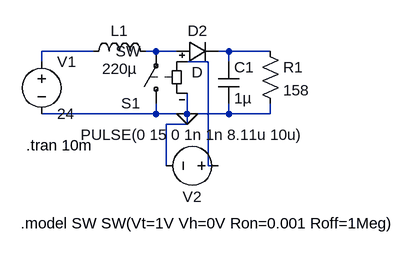
[diagram p0: schematic simulation.asc]
simulation.asc, the LTspice schematic file:
Version 4.1
SHEET 1 2348 680
WIRE 176 96 96 96
WIRE 272 96 256 96
WIRE 304 96 272 96
WIRE 384 96 368 96
WIRE 448 96 384 96
WIRE 96 112 96 96
WIRE 352 112 320 112
WIRE 384 112 384 96
WIRE 272 192 272 176
WIRE 272 192 96 192
WIRE 320 192 320 160
WIRE 320 192 272 192
WIRE 384 192 384 176
WIRE 384 192 320 192
WIRE 448 192 448 176
WIRE 448 192 384 192
WIRE 320 208 320 192
WIRE 320 208 288 208
WIRE 288 272 288 208
WIRE 352 272 352 112
WIRE 368 272 352 272
FLAG 320 192 0
SYMBOL voltage 96 96 R0
WINDOW 123 0 0 Left 0
WINDOW 39 0 0 Left 0
SYMATTR InstName V1
SYMATTR Value 24
SYMBOL ind 160 112 R270
WINDOW 0 32 56 VTop 2
WINDOW 3 5 56 VBottom 2
SYMATTR InstName L1
SYMATTR Value 220µ
SYMATTR SpiceLine Rser=1m
SYMBOL cap 368 112 R0
SYMATTR InstName C1
SYMATTR Value 1µ
SYMBOL res 432 80 R0
SYMATTR InstName R1
SYMATTR Value 158
SYMBOL voltage 384 272 R90
WINDOW 0 32 56 VTop 2
WINDOW 3 -32 56 VBottom 2
WINDOW 123 0 0 Left 0
WINDOW 39 0 0 Left 0
SYMATTR InstName V2
SYMATTR Value PULSE(0 15 0 1n 1n 8.11u 10u)
SYMBOL sw 272 192 R180
SYMATTR InstName S1
SYMBOL diode 304 112 R270
WINDOW 0 32 32 VTop 2
WINDOW 3 0 32 VBottom 2
SYMATTR InstName D2
TEXT 64 360 Left 2 !.model SW SW(Vt=1V Vh=0V Ron=0.001 Roff=1Meg)
TEXT 72 240 Left 2 !.tran 10m

The netlist it stands for:
* simulation.asc
V1 N001 0 24
L1 N001 N002 220µ Rser=1m
C1 N003 0 1µ
R1 N003 0 158
V2 N004 0 PULSE(0 15 0 1n 1n 8.11u 10u)
S1 0 N002 N004 0 SW
D2 N002 N003 D
.model D D
.lib standard.dio
.model SW SW(Vt=1V Vh=0V Ron=0.001 Roff=1Meg)
.tran 10m
.backanno
.end